# EAGLE schematic rega (EAGLE 9.5.0)
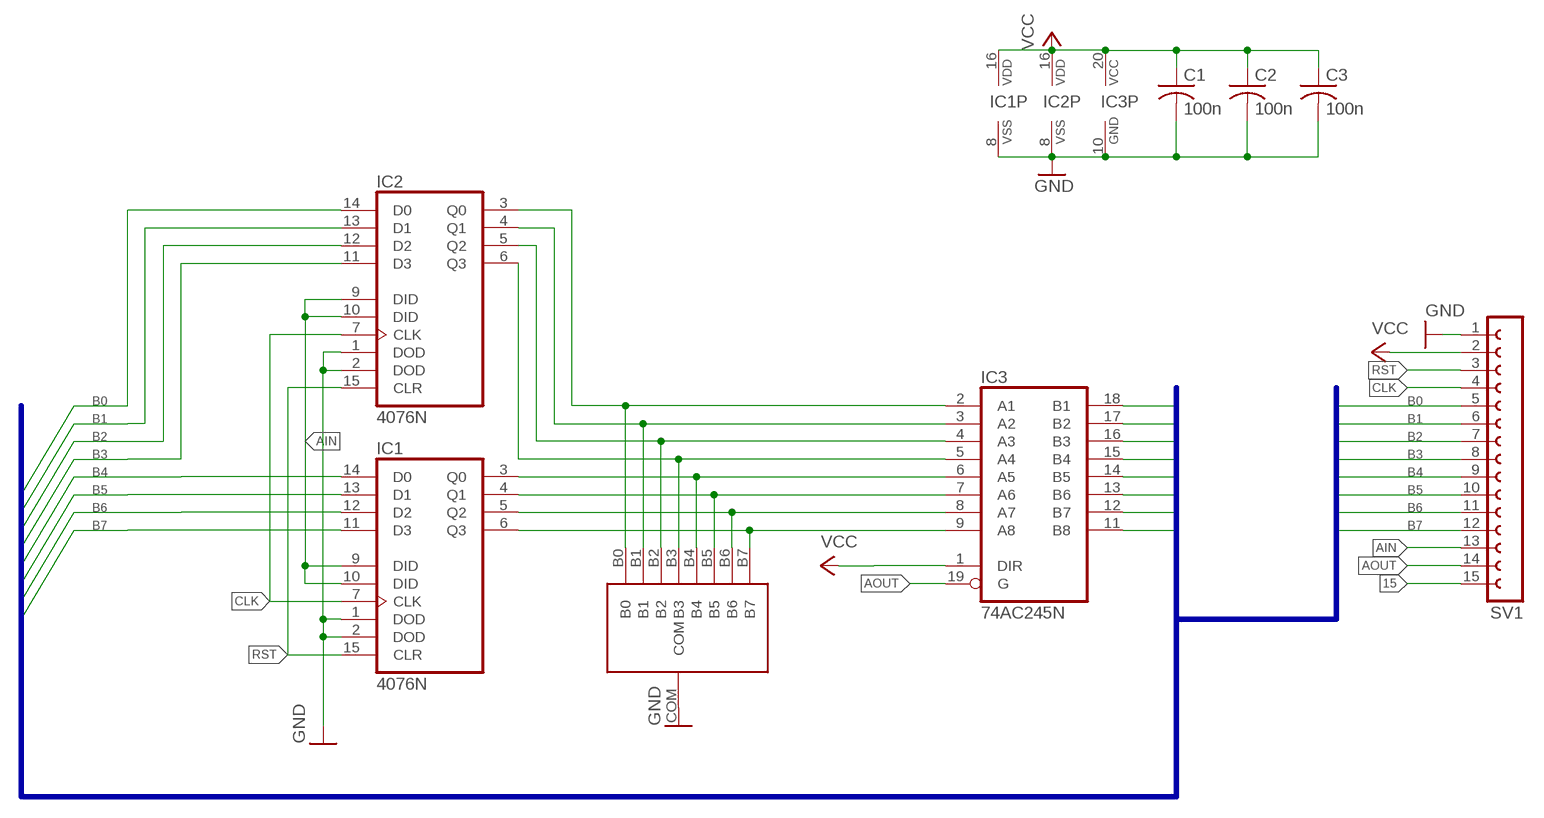
[diagram p0: schematic, sheet 1]

## Parts
C1  100n  C-US050-025X075  [C050-025X075]
C2  100n  C-US050-025X075  [C050-025X075]
C3  100n  C-US050-025X075  [C050-025X075]
IC1  4076N  [DIL16]
IC2  4076N  [DIL16]
IC3  74AC245N  [DIL20]
SV1  FE15-1  [FE15]
U$1  LEDEDGEGRAPH  [LEDEDGEGRAPH]

## Nets
15: SV1.15
AIN: IC1.9(DID) IC1.10(DID) IC2.9(DID) IC2.10(DID) SV1.13
AOUT: IC3.19(G) SV1.14
B0: IC2.14(D0) IC3.18(B1) SV1.5
B1: IC2.13(D1) IC3.17(B2) SV1.6
B2: IC2.12(D2) IC3.16(B3) SV1.7
B3: IC2.11(D3) IC3.15(B4) SV1.8
B4: IC1.14(D0) IC3.14(B5) SV1.9
B5: IC1.13(D1) IC3.13(B6) SV1.10
B6: IC1.12(D2) IC3.12(B7) SV1.11
B7: IC1.11(D3) IC3.11(B8) SV1.12
CLK: IC1.7(CLK) IC2.7(CLK) SV1.4
GND: C1.2 C2.2 C3.2 IC1.1(DOD) IC1.2(DOD) IC1.8(VSS) IC2.1(DOD) IC2.2(DOD) IC2.8(VSS) IC3.10(GND) SV1.1 U$1.COM
N$1: IC1.3(Q0) IC3.6(A5) U$1.B4
N$2: IC1.4(Q1) IC3.7(A6) U$1.B5
N$3: IC1.5(Q2) IC3.8(A7) U$1.B6
N$4: IC1.6(Q3) IC3.9(A8) U$1.B7
N$5: IC2.6(Q3) IC3.5(A4) U$1.B3
N$6: IC2.5(Q2) IC3.4(A3) U$1.B2
N$7: IC2.4(Q1) IC3.3(A2) U$1.B1
N$8: IC2.3(Q0) IC3.2(A1) U$1.B0
RST: IC1.15(CLR) IC2.15(CLR) SV1.3
VCC: C1.1 C2.1 C3.1 IC1.16(VDD) IC2.16(VDD) IC3.1(DIR) IC3.20(VCC) SV1.2

## Buses
DATA:B0,B1,B2,B3,B4,B5,B6,B7

## Library data of the parts
C1-C3 = rcl:C-US: CAPACITOR, American symbol; SPICEPREFIX: C
IC1 IC2 = 40xx:4076: Quad D-type REGISTER
IC3 = 74xx-eu:74*245: Octal BUS TRANSCEIVER, 3-state
SV1 = con-lsta:FE15-1: FEMALE HEADER; OC_FARNELL: unknown; OC_NEWARK: unknown
U$1 = 7_segment_lib:LEDEDGEGRAPH